# Altium project Home Automation.PrjPcb
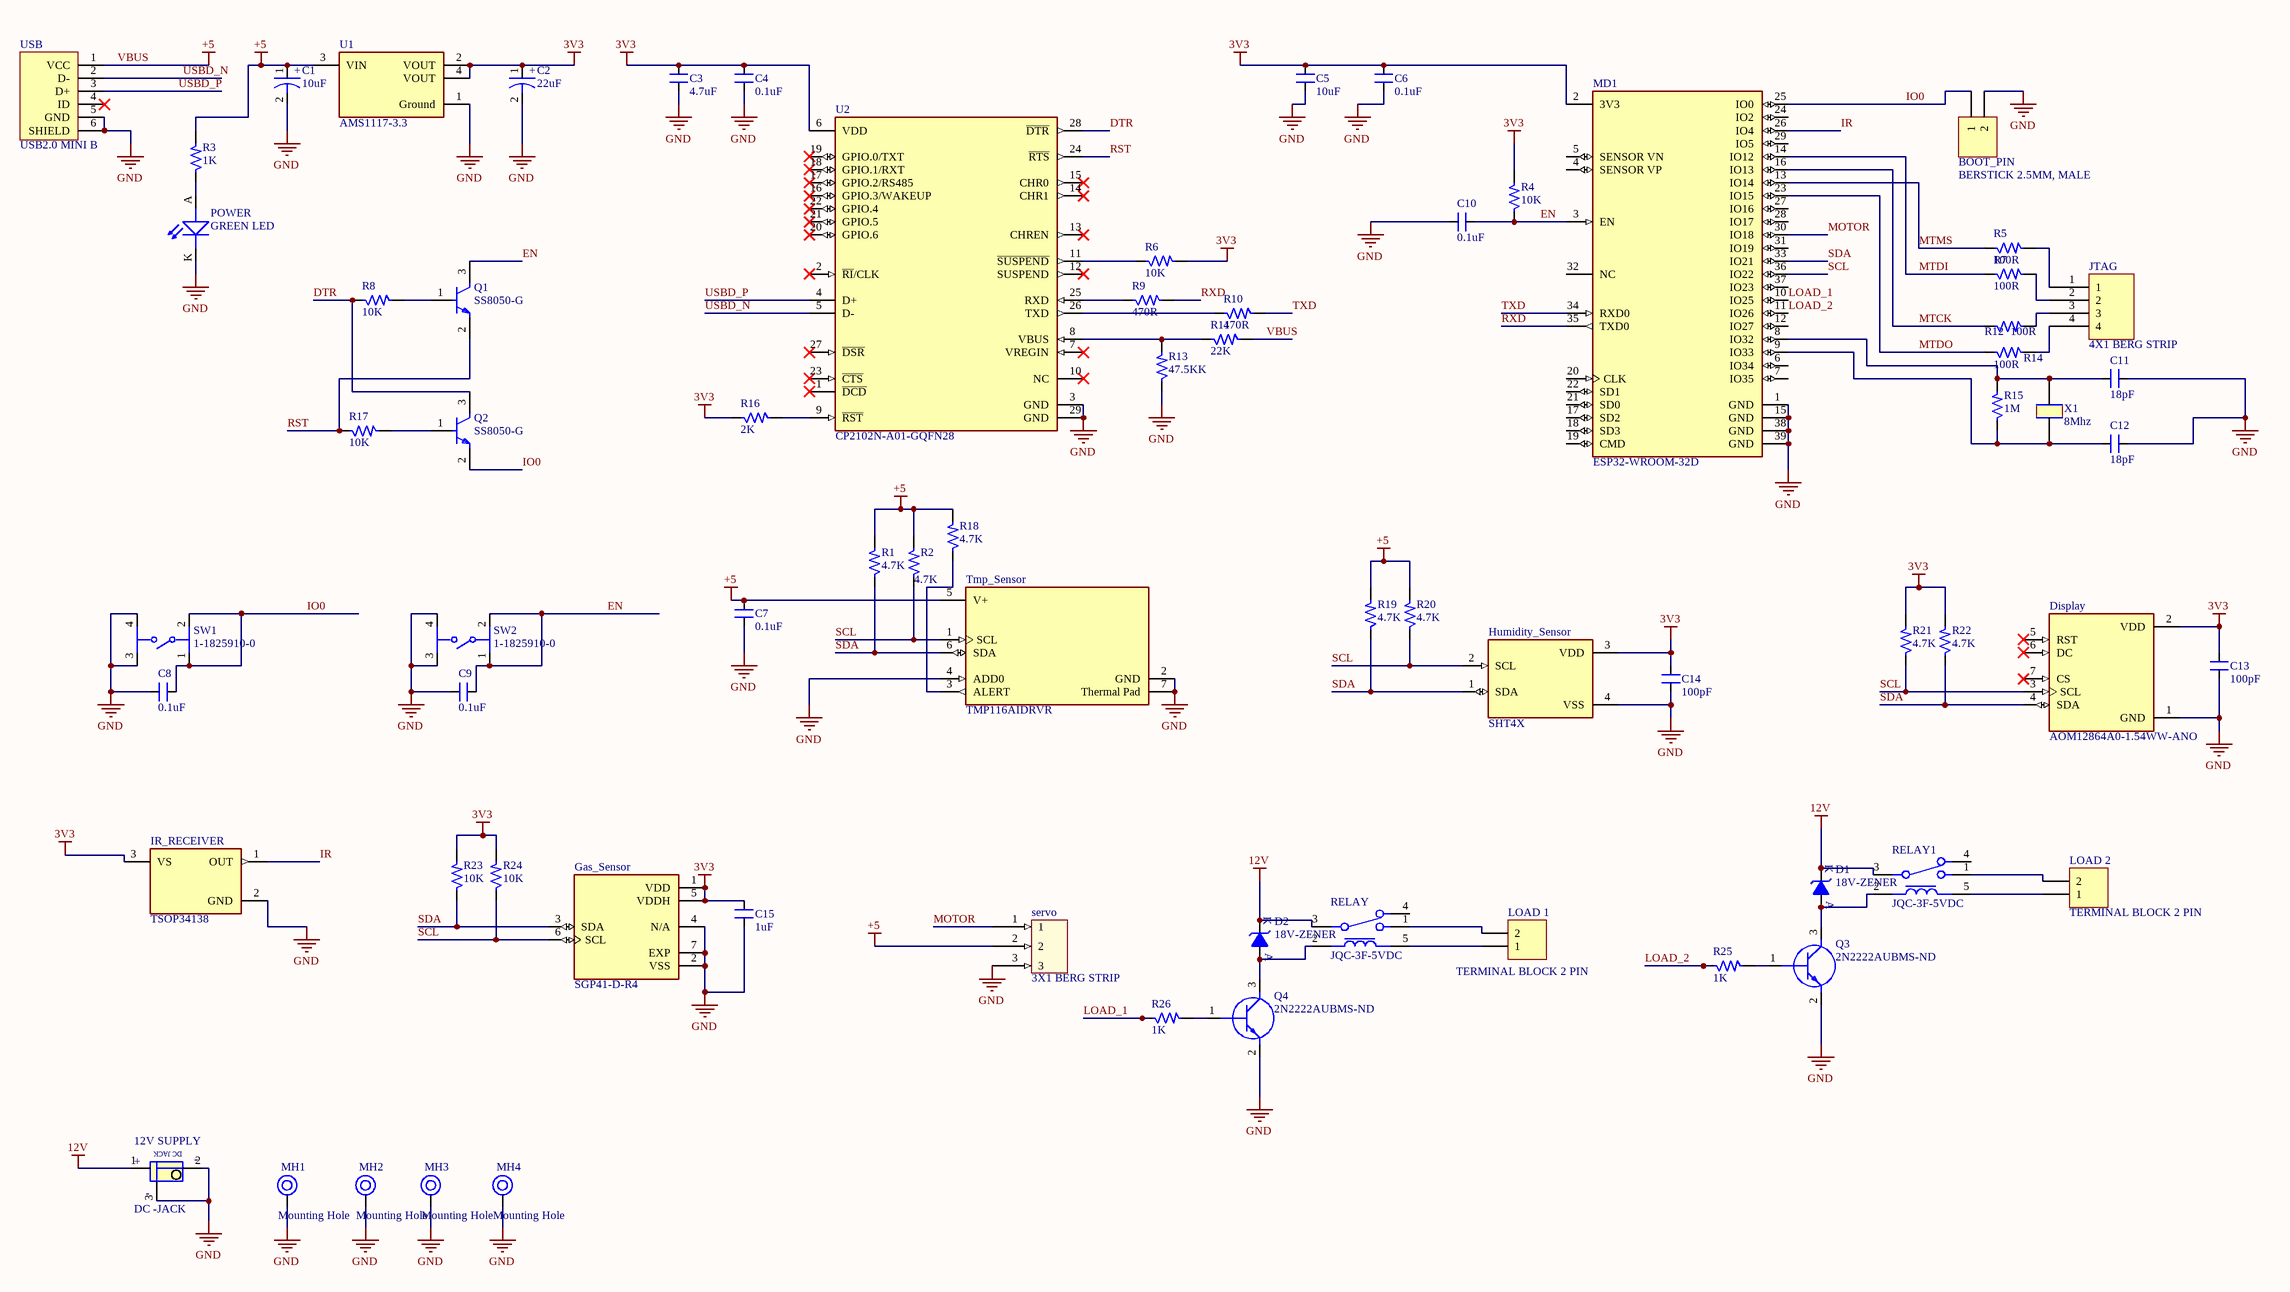
[diagram p0: Home_Automation.SchDoc]
1 sheet, 72 parts. Net scope: global (net labels, ports and power ports of the same name join across sheets).
Board file: Home Automation.PcbDoc

## Sheet Home_Automation.SchDoc
size A0; SheetNumber: 1; SheetTotal: 1

### Parts
12V_SUPPLY  DC -JACK  [CON3_129_PJ-002A_TH_RA]
BOOT_PIN  BERSTICK 2.5MM, MALE  [CON2_100_43D62_TH_ST]
C1  10uF  [ACAP_P339_D393_H531_RAD]
C2  22uF  [ACAP_P339_D393_H531_RAD]
C3  4.7uF  [CAP_0805]
C4  0.1uF  [CAP_0805]
C5  10uF  [CAP_0805]
C6  0.1uF  [CAP_0805]
C7  0.1uF  [CAP_0805]
C8  0.1uF  [CAP_0805]
C9  0.1uF  [CAP_0805]
C10  0.1uF  [CAP_0805]
C11  18pF  [CAP_0805]
C12  18pF  [CAP_0805]
C13  100pF  [CAP_0805]
C14  100pF  [CAP_0805]
C15  1uF  [CAP_0805]
D1  18V-ZENER  [DIO_SOD80C]
D2  18V-ZENER  [DIO_SOD80C]
Display  AOM12864A0-1.54WW-ANO  [LCD_AOM12864A0-1.54WW-ANO]
Gas_Sensor  SGP41-D-R4  [XDCR_SGP41-D-R4]
Humidity_Sensor  SHT4X  [SHT4X]
IR_RECEIVER  TSOP34138  [FP-6_550-5169_01-4-MFG]
JTAG  4X1 BERG STRIP  [CON4_100_40D72_TH_ST_MALE]
LOAD_1  TERMINAL BLOCK 2 PIN  [CON2_P196_1729128_TH_ST]
LOAD_2  TERMINAL BLOCK 2 PIN  [CON2_P196_1729128_TH_ST]
MD1  ESP32-WROOM-32D  [FP-ESP32-WROOM-32D-MFG]
MH1  Mounting Hole  [MOUNTING]
MH2  Mounting Hole  [MOUNTING]
MH3  Mounting Hole  [MOUNTING]
MH4  Mounting Hole  [MOUNTING]
POWER  GREEN LED  [LED_0805]
Q1  SS8050-G  [FP-SS8050-G-MFG]
Q2  SS8050-G  [FP-SS8050-G-MFG]
Q3  2N2222AUBMS-ND  [SOT 23-3]
Q4  2N2222AUBMS-ND  [SOT 23-3]
R1  4.7K  [RES_0805]
R2  4.7K  [RES_0805]
R3  1K  [RES_0805]
R4  10K  [RES_0805]
R5  100R  [RES_0805]
R6  10K  [RES_0805]
R7  100R  [RES_0805]
R8  10K  [RES_0805]
R9  470R  [RES_0805]
R10  470R  [RES_0805]
R11  22K  [RES_0805]
R12  100R  [RES_0805]
R13  47.5KK  [RES_0805]
R14  100R  [RES_0805]
R15  1M  [RES_0805]
R16  2K  [RES_0805]
R17  10K  [RES_0805]
R18  4.7K  [RES_0805]
R19  4.7K  [RES_0805]
R20  4.7K  [RES_0805]
R21  4.7K  [RES_0805]
R22  4.7K  [RES_0805]
R23  10K  [RES_0805]
R24  10K  [RES_0805]
R25  1K  [RES_0805]
R26  1K  [RES_0805]
RELAY  JQC-3F-5VDC  [RLY_JQC_3F_5VDC]
RELAY1  JQC-3F-5VDC  [RLY_JQC_3F_5VDC]
servo  3X1 BERG STRIP  [CON3_100_40D72_TH_ST-MALE]
SW1  1-1825910-0  [FP-1-1825910-0-MFG]
SW2  1-1825910-0  [FP-1-1825910-0-MFG]
Tmp_Sensor  TMP116AIDRVR  [FP-DRV0006A-IPC_C]
U1  AMS1117-3.3  [FP-AMS1117-IPC_C]
U2  CP2102N-A01-GQFN28  [FP-CP2102N-A01-GQFN28-MFG]
USB  USB2.0 MINI B  [CON_690-005-299-043]
X1  8Mhz  [XTAL_314_240X47_SMD]

### Nets
3V3: C2.1 C3.2 C4.2 C5.2 C6.2 C13.2 C14.2 C15.2 Display.2(VDD) Gas_Sensor.1(VDD) Gas_Sensor.5(VDDH) Humidity_Sensor.3(VDD) IR_RECEIVER.3(VS) MD1.2(3V3) R4.2 R6.2 R16.1 R21.2 R22.2 R23.2 R24.2 U1.2(VOUT) U1.4(VOUT) U2.6(VDD)
12V: 12V_SUPPLY.1 D1.K D2.K RELAY.3 RELAY1.3
GND: 12V_SUPPLY.2 12V_SUPPLY.3(-) BOOT_PIN.2 C1.2 C2.2 C3.1 C4.1 C5.1 C6.1 C7.1 C8.1 C9.1 C10.2 C11.2 C12.2 C13.1 C14.1 C15.1 Display.1(GND) Gas_Sensor.2(VSS) Gas_Sensor.4(N/A) Gas_Sensor.7(EXP) Humidity_Sensor.4(VSS) IR_RECEIVER.2(GND) MD1.1(GND) MD1.15(GND) MD1.38(GND) MD1.39(GND) MH1.1 MH2.1 MH3.1 MH4.1 POWER.K(CATHODE) Q3.2(E) Q4.2(E) R13.1 servo.3 SW1.3 SW1.4 SW2.3 SW2.4 Tmp_Sensor.2(GND) Tmp_Sensor.4(ADD0) Tmp_Sensor.7(Thermal_Pad) U1.1(Ground) U2.3(GND) U2.29(GND) USB.5(GND) USB.6(SHIELD)
VBUS: C1.1 C7.2 R1.2 R2.2 R3.2 R11.2 R18.2 R19.2 R20.2 servo.2 Tmp_Sensor.5(V+) U1.3(VIN) USB.1(VCC)  [also labelled +5]
DTR: Q2.3(C) R8.1 U2.28(~{DTR})
EN: C9.2 C10.1 MD1.3(EN) Q1.3(C) R4.1 SW2.1 SW2.2
IO0: BOOT_PIN.1 C8.2 MD1.25(IO0) Q2.2(E) SW1.1 SW1.2
IR: IR_RECEIVER.1(OUT) MD1.26(IO4)
LOAD_1: MD1.10(IO25) R26.1
LOAD_2: MD1.11(IO26) R25.1
MOTOR: MD1.30(IO18) servo.1
MTCK: MD1.16(IO13) R12.1
MTDI: MD1.14(IO12) R7.1
MTDO: MD1.23(IO15) R14.1
MTMS: MD1.13(IO14) R5.1
RST: Q1.2(E) R17.1 U2.24(~{RTS})
RXD: MD1.35(TXD0) R9.2
SCL: Display.3(SCL) Gas_Sensor.6(SCL) Humidity_Sensor.2(SCL) MD1.36(IO22) R2.1 R20.1 R21.1 R24.1 Tmp_Sensor.1(SCL)
SDA: Display.4(SDA) Gas_Sensor.3(SDA) Humidity_Sensor.1(SDA) MD1.33(IO21) R1.1 R19.1 R22.1 R23.1 Tmp_Sensor.6(SDA)
TXD: MD1.34(RXD0) R10.2
USBD_N: U2.5(D-) USB.2(D-)
USBD_P: U2.4(D+) USB.3(D+)
NetC11_1: C11.1 MD1.8(IO32) R15.2 X1.2
NetC12_1: C12.1 MD1.9(IO33) R15.1 X1.1
NetD1_A: D1.A Q3.3(C) RELAY1.2
NetD2_A: D2.A Q4.3(C) RELAY.2
NetJTAG_1: JTAG.1 R5.2
NetJTAG_2: JTAG.2 R7.2
NetJTAG_3: JTAG.3 R12.2
NetJTAG_4: JTAG.4 R14.2
NetLOAD_1_1: LOAD_1.1 RELAY.5
NetLOAD_1_2: LOAD_1.2 RELAY.1
NetLOAD_2_1: LOAD_2.1 RELAY1.5
NetLOAD_2_2: LOAD_2.2 RELAY1.1
NetPOWER_A: POWER.A(ANODE) R3.1
NetQ1_1: Q1.1(B) R8.2
NetQ2_1: Q2.1(B) R17.2
NetQ3_1: Q3.1(B) R25.2
NetQ4_1: Q4.1(B) R26.2
NetR6_1: R6.1 U2.11(~{SUSPEND})
NetR9_1: R9.1 U2.25(RXD)
NetR10_1: R10.1 U2.26(TXD)
NetR11_1: R11.1 R13.2 U2.8(VBUS)
NetR16_2: R16.2 U2.9(~{RST})
NetR18_1: R18.1 Tmp_Sensor.3(ALERT)

Not connected (* = marked no-connect by the designer): Display 5(RST)* 6(DC)* 7(CS)*; MD1 4(SENSOR_VP) 5(SENSOR_VN) 6(IO34) 7(IO35) 12(IO27) 17(SD2) 18(SD3) 19(CMD) 20(CLK) 21(SD0) 22(SD1) 24(IO2) 27(IO16) 28(IO17) 29(IO5) 31(IO19) 32(NC) 37(IO23); RELAY 4; RELAY1 4; U2 1(~{DCD})* 2(~{RI}/CLK)* 7(VREGIN)* 10(NC)* 12(SUSPEND)* 13(CHREN)* 14(CHR1)* 15(CHR0)* 16(GPIO.3/WAKEUP)* 17(GPIO.2/RS485)* 18(GPIO.1/RXT)* 19(GPIO.0/TXT)* 20(GPIO.6)* 21(GPIO.5)* 22(GPIO.4)* 23(~{CTS})* 27(~{DSR})*; USB 4(ID)*

### Notes on the sheet
- (in symbol CAP-P_10uF-400V-20%-RAD) +
- (in symbol CAP-P_22uF-400V-20%-RAD) +
- (in symbol CON-PLG_3X1-228-DC_JACK) DC JACK; +

### Library data of the parts
12V_SUPPLY = CON-PLG_3X1-228-DC_JACK: 3 Pins, 1 Row 228mil Pitch, right angle Connector, male; Manufacturer: JST; Manufacturer Part Number: PJ-002A; Alternate Part Number-1: NA; Case/Package: TH-CON; Supplier-1: SP ROAD; Supplier Part Number-1: NA
BOOT_PIN = CON-BS-PLG_2X1-100-ST-TH: 2 Pins, 1 Row 2.54mm Pitch, Straight bergstrip, Male; Manufacturer Part Number: NA; Manufacturer: Samtec; Case/Package: TH-CON; Supplier-1: SP ROAD; Supplier Part Number-1: NA; Alternate Part Number-1: NA
C1 = CAP-P_10uF-400V-20%-RAD: 10µF 400V Aluminum Electrolytic Capacitors Radial, Can - SMD 10000 Hrs @ 105°C; Manufacturer: Nichicon; Manufacturer Part Number: ULV2G100MNL1GS; Alternate Part Number-1: NA; Case/Package: Radial-SMD; Supplier-1: SP ROAD; Supplier Part Number-1: ULV2G100MNL1GS
C2 = CAP-P_22uF-400V-20%-RAD: 22µF 400V Aluminum Electrolytic Capacitors Radial, Can - SMD 5000 Hrs @ 105°C; Manufacturer: Panasonic Electronic Components; Manufacturer Part Number: EEV-EB2G220M; Alternate Part Number-1: NA; Case/Package: Radial-SMD; Supplier-1: Mouser; Supplier Part Number-1: 667-EEV-EB2G220M
C3 = CAP_4.7uF-50V-10%-0805: 4.7µF ±10% 50V Ceramic Capacitor X5R 0805 (2012 Metric); Manufacturer: Yageo; Manufacturer Part Number: GRM21BR61H475KE51L; Alternate Part Number-1: NA; Case/Package: 0805; Supplier-1: SIRICOM; Supplier Part Number-1: CL21A475KBQNNNE
C4 = CAP_0.1uF-50V-10%-0805: 0.1µF ±10% 50V Ceramic Capacitor X7R 0805 (2012 Metric); Manufacturer: Samsung; Manufacturer Part Number: CL21B104KBCNNNC; Alternate Part Number-1: NA; Case/Package: 0805; Supplier-1: SIRICOM; Supplier Part Number-1: 0805B104K500CT
C5 C13 C14 = CAP_100pF-100V-5%-0805: 100pF ±5% 100V Ceramic Capacitor C0G, NP0 0805 (2012 Metric); Manufacturer: Murata; Manufacturer Part Number: CL21C101JC61PNC; Alternate Part Number-1: NA; Case/Package: 0805; Supplier-1: SIRICOM; Supplier Part Number-1: 0805N101J101CT
C6-C10 = CAP_0.1uF-50V-5%-0805: 0.1µF ±5% 50V Ceramic Capacitor X7R 0805 (2012 Metric); Manufacturer: AVX Corporation; Manufacturer Part Number: 08055C104JAT4A; Alternate Part Number-1: 0805B104M500; Case/Package: 0805; Supplier-1: SIRICOM; Supplier Part Number-1: 0805B104J500CT
C11 C12 = CAP_18pF-50V-5%-0805: 18pF ±5% 50V Ceramic Capacitor C0G, NP0 0805 (2012 Metric); Manufacturer: Yageo; Manufacturer Part Number: CL21C180JBANNNC; Alternate Part Number-1: NA; Case/Package: 0805; Supplier-1: NA; Supplier Part Number-1: NA
C15 = CAP_1uF-50V-5%-0805: 1µF ±5% 50V Ceramic Capacitor X7R 0805 (2012 Metric); Manufacturer: Samsung; Manufacturer Part Number: CC0805JKX7R9BB105; Alternate Part Number-1: 0805F105M500NT; Case/Package: 0805; Supplier-1: SIRICOM; Supplier Part Number-1: CL21B105KBFNNNE
D1 D2 = DIO-Z_18V-500mW-SOD80: Zener Diode 18V 500mW ±5% Surface Mount SOD-80 QuadroMELF; Manufacturer: Vishay Semiconductors; Manufacturer Part Number: BZT55C18-GS08; Alternate Part Number-1: NA; Case/Package: SOD80; Supplier-1: SIRICOM; Supplier Part Number-1: BZV55-C18
Display = AOM12864A0-1.54WW-ANO: Non-Touch Graphic LCD Display Module - White OLED SPI 1.54 (39.12mm) 128 x 64; MF: Orient Display; Price: None; Value: *; Package: None; Check_prices: https://www.snapeda.com/parts/AOM12864A0-1.54WW-ANO/Orient+Display/view-part/?ref=eda; SnapEDA_Link: https://www.snapeda.com/parts/AOM12864A0-1.54WW-ANO/Orient+Display/view-part/?ref=snap; Purchase-URL: https://pricing.snapeda.com/search/part/AOM12864A0-1.54WW-ANO/?ref=eda; Availability: In Stock; MP: AOM12864A0-1.54WW-ANO
Gas_Sensor = SGP41-D-R4: Air Quality Sensor VOC and NOx Gas Sensor 3.3V 6-Pin DFN EP; MF: Sensirion; Purchase-URL: https://pricing.snapeda.com/search/part/SGP41-D-R4/?ref=eda; Package: None; MP: SGP41-D-R4; Value: *; SnapEDA_Link: https://www.snapeda.com/parts/SGP41-D-R4/Sensirion/view-part/?ref=snap; Availability: In Stock; Price: None; Check_prices: https://www.snapeda.com/parts/SGP41-D-R4/Sensirion/view-part/?ref=eda
Humidity_Sensor = SHT4X: Digital Relative Humidity Temperature Sensor, Â±1.0 %RH, Â±0.1 Â°C, Ultra-Low-Power; MF: Sensirion; MP: SHT45-AD1B-R2; Price: None; Purchase-URL: https://pricing.snapeda.com/search/part/SHT45-AD1B-R2/?ref=eda; SnapEDA_Link: https://www.snapeda.com/parts/SHT45-AD1B-R2/Sensirion/view-part/?ref=snap; Availability: In Stock; Package: None; Check_prices: https://www.snapeda.com/parts/SHT45-AD1B-R2/Sensirion/view-part/?ref=eda; Value: *
IR_RECEIVER = CMP-02532-000001-1: SENSOR REMOTE REC 38.0KHZ 45M; Manufacturer: Vishay; Sensing Distance: 30m; Max Junction Temp: +100°C; Max Supply Voltage: 5.5V; Sensor Output: Other; Standoff Height: 2.5mm; Output Current: 5mA; Min Supply Voltage: 2.5V; Operating Supply Current: 3mA; Device Class L1: Sensors; Package: 6.550-5169.01-4; Device Class L3: Photoelectric Sensors; Temperature Range High: +85°C; Category: Diode; Digikey Description: SENSOR REMOTE REC 38.0KHZ 45M; Lead Free: Yes; Octopart: https://octopart.com/tsop34138-vishay-55433998; Ambient Temperature Range Low: -25°C; Ambient Temperature Range High: +85°C; Height: 10.85mm; Manufacturer Part Number: TSOP34138; ComponentLink2URL: http://www.vishay.com/docs/82490/tsop321.pdf; Device Class L2: Optical Sensors; Mouser Description: 38 kHz 45 m 2.5-5.5 V Through Hole IR Receiver Module for Remote Control System; RoHS: TRUE; Temperature: -25°C to +85°C; Automotive: No; Temperature Range Low: -25°C; ComponentLink2Description: Datasheet
JTAG = CON-BS-PLG_4X1-100-ST-TH: 4 Pins, 1 Row 2.54mm Pitch, Straight bergstrip, Male; Manufacturer: NA; Manufacturer Part Number: NA; Case/Package: TH-CON; Supplier-1: SP ROAD; Supplier Part Number-1: NA; Alternate Part Number-1: NA
LOAD_1 LOAD_2 = CON-TB_2X1-196-ST-TH: 2 Pins, 1 Row 5mm Pitch, straight Connector, male; Manufacturer: Phoenix Contact; Manufacturer Part Number: MKDSN1,5/2; Alternate Part Number-1: NA; Case/Package: TH-CON; Supplier-1: SP ROAD; Supplier Part Number-1: MKDSN1,5/2
MD1 = CMP-194065-000003-1: WIFI MODULE 32MBITS SPI FLASH; Manufacturer: Espressif Systems; Max Supply Voltage: 3.6V; Nominal Supply Current: 500mA; Max Frequency: 2484MHz; Number Of Adc Channels: 16; Number Of Gpio: 32; Interface: I2C,SPI,UART,Ethernet,I2S,Other; Data Rate: 150Mbits/s; Min Supply Voltage: 3V; Bandwidth: 72MHz; Sensitivity: -98dBm; Octopart: https://octopart.com/esp32-wroom-32d-espressif+systems-91040050; Package: ESP32-WROOM-32D; ComponentLink2URL: https://www.espressif.com/sites/default/files/documentation/esp32-wroom-32d_esp32-wroom-32u_datasheet_en.pdf; Lead Free: Yes; Category: UNK; Mouser Description: Wi-Fi/BT BLE Module ESP32-D0WD, SPI Flash, UART, P; Device Class L1: Integrated Circuits (ICs); RoHS: TRUE; Temperature Range Low: -40°C; ComponentLink2Description: Datasheet; Digikey Description: WIFI MODULE 32MBITS SPI FLASH; Height: 3.2mm; Temperature: -40°C to +85°C; Manufacturer Part Number: ESP32-WROOM-32D; Device Class L3: Transceivers; Device Class L2: RF Semiconductors and Devices; Temperature Range High: +85°C; Automotive: No
MH1-MH4 = MH_3.5H_6D: Manufacturer Part Number: NA; Case/Package: TH; Manufacturer: NA; Supplier-1: NA; Supplier Part Number-1: NA; Alternate Part Number-1: NA
POWER = LED_GREEN-2.2-20mA-0805: Green 569nm LED Indication - Discrete 2.1V 0805 (2012 Metric); Manufacturer: Vishay Lite-On; Manufacturer Part Number: LTST-C171GKT; Alternate Part Number-1: NA; Case/Package: 0805; Supplier-1: SP ROAD; Supplier Part Number-1: LTST-C171GKT
Q1 Q2 = CMP-20235-000001-1: NPN TRANSISTOR 1.5A 40V SOT-23 R; Transition Frequency: 100MHz; Max Breakdown Voltage: 25V; Collector Emitter Voltage (VCEO): 400mV; Max Power Dissipation: 300mW; Max Collector Current: 1.5A; Case/Package: TO-236-3; Packaging: Tape and Reel; RoHS Compliant: Yes; Mount: Surface Mount; Collector Emitter Breakdown Voltage: 25V
Q3 Q4 = TRNS-NPN_50V-0.8A-3SMD: Bipolar (BJT) Transistor NPN 50V 800mA 500mW Surface Mount 3-SMD; Manufacturer: Microsemi; Alternate Part Number-1: NA; Manufacturer Part Number: 2N2222AUB; Case/Package: SOT23-3; Supplier-1: MOUSER; Supplier Part Number-1: 2N2222AUB
R1 R2 R18-R22 = RES_4.7K-0.125W-1%-0805: 4.7 kOhms ±1% 0.125W, 1/8W Chip Resistor 0805 (2012 Metric) Moisture Resistant Thick Film; Manufacturer: TE Connectivity; Manufacturer Part Number: RC0805FR-074K7L; Alternate Part Number-1: 0805W8F4701T5E; Case/Package: 0805; Supplier-1: SIRICOM; Supplier Part Number-1: WR08X4701FTL
R3 R25 R26 = RES_1K-0.125W-1%-0805: 1 kOhms ±1% 0.125W, 1/8W Chip Resistor 0805 (2012 Metric) Moisture Resistant Thick Film; Manufacturer: Walsin; Manufacturer Part Number: WR08X1001FTL; Case/Package: 0805; Supplier-1: SP ROAD; Supplier Part Number-1: RC0805JR-071KL; Alternate Part Number-1: WR08X1001FTL
R4 R6 R8 R17 R23 R24 = RES_10K-0.125W-1%-0805: 10 kOhms ±1% 0.125W, 1/8W Chip Resistor 0805 (2012 Metric) Automotive AEC-Q200 Thick Film; Manufacturer: CTS; Manufacturer Part Number: WR08X1002FTL; Case/Package: 0805; Supplier-1: SIRICOM; Supplier Part Number-1: WR08X1002FTL; Alternate Part Number-1: WR08X1002FTL
R5 R7 R12 R14 = RES_100R-0.125W-1%-0805: 100 Ohms ±1% 0.125W, 1/8W Chip Resistor 0805 (2012 Metric) Automotive AEC-Q200, Pulse Withstanding Thick Film; Manufacturer: Walsin; Manufacturer Part Number: WR08X1000FTL; Case/Package: 0805; Supplier-1: SIRICOM; Supplier Part Number-1: WR08X1000FTL; Alternate Part Number-1: WR08X1000FTL
R9 R10 = RES_470R-0.125W-1%-0805: 470 Ohms ±1% 0.125W, 1/8W Chip Resistor 0805 (2012 Metric) Automotive AEC-Q200 Thick Film; Manufacturer: Walsin; Manufacturer Part Number: WR08X4700FTL; Alternate Part Number-1: NA; Case/Package: 0805; Supplier-1: SIRICOM; Supplier Part Number-1: WR08X4700FTL
R11 R13 = RES_22K-0.125W-1%-0805: 22 kOhms ±1% 0.125W, 1/8W Chip Resistor 0805 (2012 Metric) Automotive AEC-Q200 Thick Film; Manufacturer: Walsin; Manufacturer Part Number: WR08X2202FTL; Alternate Part Number-1: NA; Case/Package: 0805; Supplier-1: SIRICOM; Supplier Part Number-1: WR08X2202FTL
R15 = RES_1M-0.125W-1%-0805: 1 MOhms ±1% 0.125W, 1/8W Chip Resistor 0805 (2012 Metric) Automotive AEC-Q200 Thick Film; Manufacturer: Walsin; Manufacturer Part Number: WR08X1004FTL; Alternate Part Number-1: 0805W8F1004T5E; Case/Package: 0805; Supplier-1: SIRICOM; Supplier Part Number-1: WR08X1004FTL
R16 = RES_2K-0.125W-1%-0805: 2 kOhms ±1% 0.125W, 1/8W Chip Resistor 0805 (2012 Metric) Moisture Resistant Thick Film; Manufacturer: TE Connectivity; Manufacturer Part Number: RC0805FR-072KL; Alternate Part Number-1: NA; Case/Package: 0805; Supplier-1: SIRICOM; Supplier Part Number-1: WR08X2001FTL
RELAY RELAY1 = RLY2_5V-7.5A: 5V DC RELAY 2 CHANNEL; Manufacturer: YUEQING HENGWEI ELECTRONICS; Alternate Part Number-1: NA; Manufacturer Part Number: JQC-3F-5VDC; Case/Package: RLY_JQC-3F-5DC; Supplier-1: SP ROAD; Supplier Part Number-1: JQC-3F-5VDC
servo = CON-BS-PLG_3X1-100-ST-TH: 3 Pins, 1 Row 2.54mm Pitch, Straight bergstrip, Male; Manufacturer: NA; Manufacturer Part Number: RKI-1140; Case/Package: TH-CON; Supplier-1: SP ROAD; Supplier Part Number-1: NA; Alternate Part Number-1: NA
SW1 SW2 = CMP-03407-000018-1: SWITCH TACTILE SPST-NO 0.05A 24V; Switch Function: Off-Mom; Mechanical Life: 100000Cycles; Actuator Material: Nylon; Actuator Color: Blue; Contact Current Rating: 50mA; Illumination Type: Non-Illuminated; Throw Configuration: SPST; Actuator Length: 3.4mm; Operating Force: 1.56N; Actuator Type: Standard; Contact Resistance: 100mR; Switch Travel: 0.25mm; Depth: 5.99mm; Contact Plating: Silver; Max Operating Temperature: 85°C; Electrical Life: 100000Cycles; Min Operating Temperature: -35°C; RoHS Compliant: Yes; Max Voltage Rating (DC): 24V; Mount: Through Hole; Packaging: Loose Piece; Length: 5.99mm; Series: FSMJ, Alcoswitch; Orientation: Straight; Contact Material: Brass; Radiation Hardening: No; Package Quantity: 750; Max Current Rating: 50mA; Termination: PC Pins; Type: Switch; Voltage Rating (DC): 24V
Tmp_Sensor = CMP-04948-000045-1: SENSOR DIGITAL -55C-125C 6WSON; Resolution: 16b; Output Type: I2C; Mount: Surface Mount; Max Operating Temperature: 150°C; Interface: I2C; RoHS Compliant: Yes; Packaging: Tape and Reel; Min Operating Temperature: -55°C
U1 = CMP-209535-000001-1: LDO Voltage Regulators 1A, 3.3V; Manufacturer: Advanced Monolithic Systems; Dropout Voltage: 1.1V; Output Type: Fixed; Nominal Supply Current: 5mA; Max Power Dissipation: 1.2W; Max Supply Voltage: 15V; Number Of Outputs: 1; Standoff Height: 0.64mm; Max Junction Temp: +125°C; Height: 1.8mm; Package: AMS1117; Device Class L2: Power Management ICs; ComponentLink2Description: Datasheet; ComponentLink2URL: http://www.advanced-monolithic.com/pdf/ds1117.pdf; Category: IC; RoHS: TRUE; Automotive: No; Device Class L1: Integrated Circuits (ICs); Output Current: 1A; Device Class L3: Voltage Regulators - Linear; Temperature: -40°C to +125°C; Output Voltage: 3.3V; Manufacturer Part Number: AMS1117-3.3; Temperature Range Low: -40°C; Octopart: https://octopart.com/ams1117-3.3-advanced+monolithic+systems-25899300; Lead Free: Yes; Ipc Land Pattern Name: SOT229P700X180-4; Temperature Range High: +125°C
U2 = CMP-08093-000004-1: IC BRIDGE USB TO UART 28QFN; Manufacturer: Silicon Labs; Standoff Height: 0mm; Max Junction Temp: +105°C; Usb Standard: USB 2.0; Number Of Ports: 1; Nominal Supply Current: 195-13700uA; Min Supply Voltage: 1.71V; Max Supply Voltage: 5.25V; Interface: UART,USB,RS-232,RS-485; Height: 0.8mm; Package: CP2102N-A01-GQFN28; Temperature Range Low: -40°C; Lead Free: Yes; Category: IC; Ambient Temperature Range High: +85°C; Device Class L3: USB Interface ICs; Octopart: https://octopart.com/cp2102n-a01-gqfn28-silicon+labs-74636024; Manufacturer Part Number: CP2102N-A01-GQFN28; Device Class L2: Interface ICs; ComponentLink2URL: https://media.digikey.com/pdf/Data%20Sheets/Silicon%20Laboratories%20PDFs/CP2102N_Rev.1.3_DS.pdf; Automotive: No; Temperature: -40°C to +85°C; Device Class L1: Integrated Circuits (ICs); Mouser Description: IC BRIDGE USB TO UART 28QFN; RoHS: TRUE; Ambient Temperature Range Low: -40°C; Temperature Range High: +85°C; Ipc Land Pattern Name: QFN50P500X500X75-28; Digikey Description: IC BRIDGE USB TO UART 28QFN; ComponentLink2Description: Datasheet
USB = CON_USB2.0-MINIB-SMD: USB - mini B USB 2.0 Receptacle Connector 5 Position Surface Mount, Right Angle; Manufacturer: EDAC; Manufacturer Part Number: 690-005-299-043; Alternate Part Number-1: NA; Case/Package: USB-MINI-B; Supplier-1: LCSC; Supplier Part Number-1: C105424
X1 = XTAL_8MHZ-ECS-80-32-5PX-SMD: 8MHz ±30ppm Crystal 32pF 60 Ohms HC-49/US; Manufacturer: Fox Electronics; Manufacturer Part Number: ECS-80-32-5PX-TR; Alternate Part Number-1: NA; Case/Package: SMD/SMT; Supplier-1: SP ROAD; Supplier Part Number-1: ECS-80-32-5PX-TR